# Altium schematic sheet RS485.SchDoc
size A4
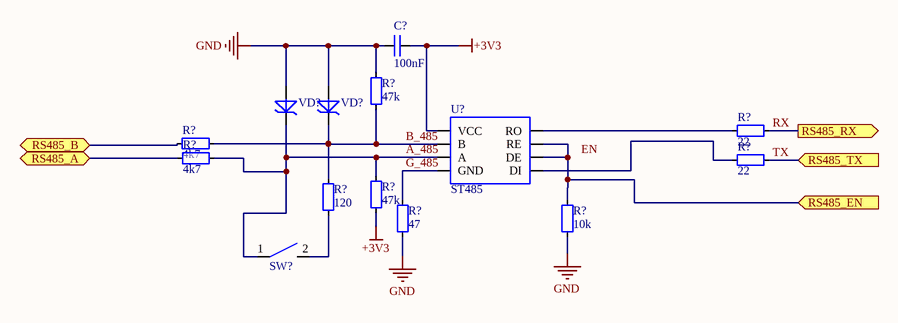
[diagram p0: RS485.SchDoc]

## Parts
(Parts that share a designator on the sheet are numbered #1, #2 ... from top to bottom, then left to right.)
C?  100nF  [SMD_0805]
R?#1  47k  [SMD_0805]
R?#2  22  [SMD_0805]
R?#3  4k7  [SMD_0805]
R?#4  4k7  [SMD_0805]
R?#5  22  [SMD_0805]
R?#6  120  [SMD_0805]
R?#7  47k  [SMD_0805]
R?#8  47  [SMD_0805]
R?#9  10k  [SMD_0805]
SW?  SW_DIP/2.54  [DIP-SW/2.54/1]  (value not drawn)
U?  ST485  [SO8-150mil]
VD?#1  (no value)  [DO214-AC]
VD?#2  (no value)  [DO214-AC]

## Ports
RS485_A (bidir), RS485_B (bidir), RS485_EN (in), RS485_RX (out), RS485_TX (in)

## Nets
+3V3: C?.2 R?#7.1 U?.8(VCC)
GND: C?.1 R?#1.2 R?#8.1 R?#9.1 VD?#1.2 VD?#2.2
A_485: R?#4.1 R?#7.2 SW?.1 U?.6(A) VD?#1.1
B_485: R?#1.1 R?#3.1 R?#6.2 U?.7(B) VD?#2.1
G_485: R?#8.2 U?.5(GND)
RS485_A: R?#4.2 ; port RS485_A
RS485_B: R?#3.2 ; port RS485_B
RS485_EN: R?#9.2 U?.2(RE) U?.3(DE) ; port RS485_EN
RX: R?#2.1 ; port RS485_RX
TX: R?#5.1 ; port RS485_TX
NetR?#2_2: R?#2.2 U?.1(RO)
NetR?#5_2: R?#5.2 U?.4(DI)
NetR?#6_1: R?#6.1 SW?.2

Not connected (* = marked no-connect by the designer): SW? 3 4

## Notes on the sheet
- Labels drawn without touching a wire or pin: EN

## Library data of the parts
C? = C_NONE_POLAR: None polar capacitor; Value: 100nF; Case: 0805
R?#1-R?#9 = RES: Resistor; Case: 0805
  R?#1 R?#7: Value: 47k
  R?#2 R?#5: Value: 22
  R?#3 R?#4: Value: 4k7
  R?#6: Value: 120
  R?#8: Value: 47
  R?#9: Value: 10k
SW? = SW: Switch
U? = ST485: RS485 interface
VD?#1 VD?#2 = DIOSE_TVS: TVS Diode